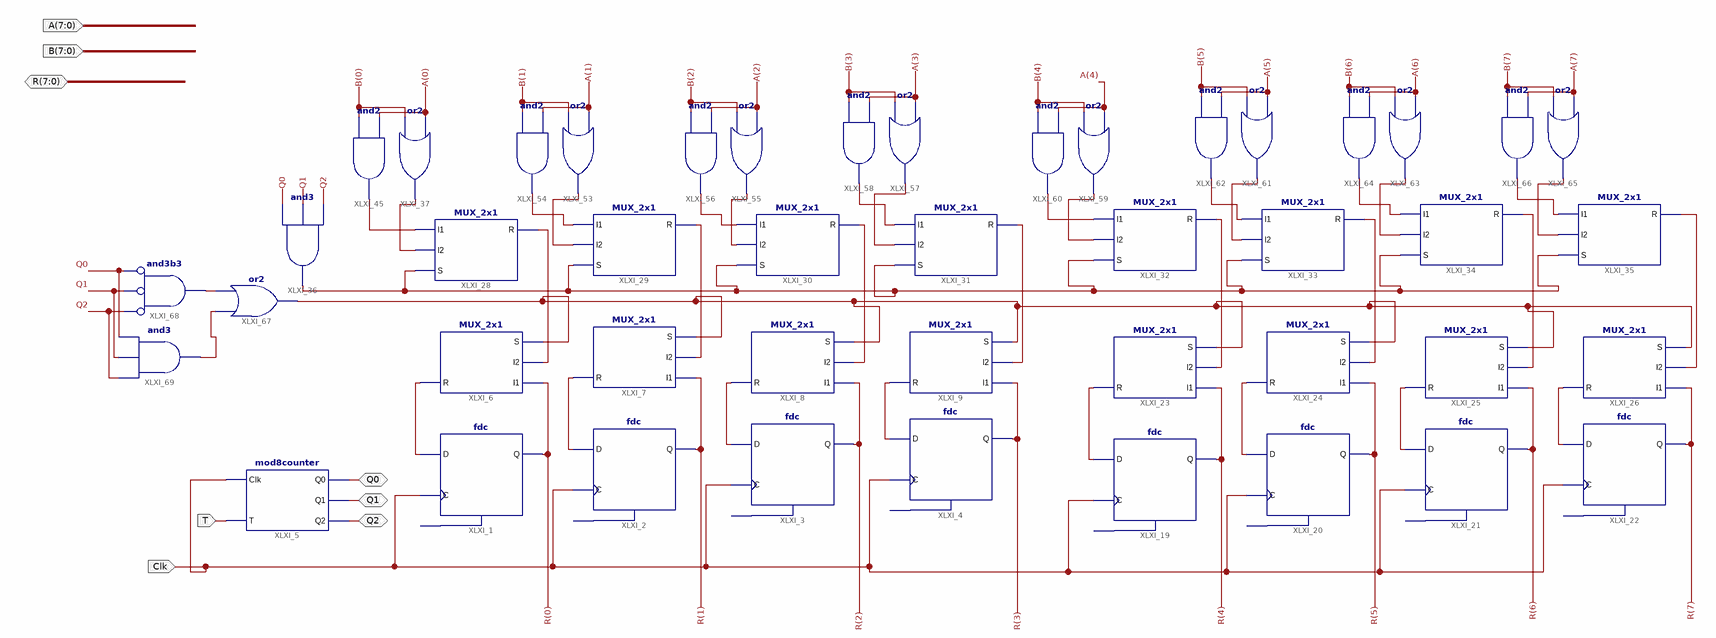
[diagram p0: schematic sheet 1]
// Xilinx ISE schematic first_h.sch (spartan3) as structural Verilog: 45 symbols, 8 ports
module first_h (
  input  T,
  input  Clk,
  input  [7:0] A,
  input  [7:0] B,
  inout  Q0,
  inout  Q2,
  inout  Q1,
  inout  [7:0] R
);

  wire XLXN_7, XLXN_8, XLXN_9, XLXN_10, XLXN_15, XLXN_40, XLXN_41, XLXN_42, XLXN_43, XLXN_54, XLXN_55,
       XLXN_56, XLXN_57, XLXN_58, XLXN_59, XLXN_60, XLXN_61, XLXN_70, XLXN_90, XLXN_91, XLXN_92, XLXN_93,
       XLXN_94, XLXN_96, XLXN_97, XLXN_98, XLXN_100, XLXN_102, XLXN_103, XLXN_104, XLXN_105, XLXN_106,
       XLXN_107, XLXN_108, XLXN_112, XLXN_113;

  fdc XLXI_1 (.C(Clk), .D(XLXN_7), .Q(R[0]));  // open: CLR
  fdc XLXI_2 (.C(Clk), .D(XLXN_8), .Q(R[1]));  // open: CLR
  fdc XLXI_3 (.C(Clk), .D(XLXN_9), .Q(R[2]));  // open: CLR
  fdc XLXI_4 (.C(Clk), .D(XLXN_10), .Q(R[3]));  // open: CLR
  mod8counter XLXI_5 (.Clk(Clk), .T(T), .Q0(Q0), .Q1(Q1), .Q2(Q2));
  MUX_2x1 XLXI_6 (.I1(R[0]), .I2(XLXN_54), .S(XLXN_15), .R(XLXN_7));
  MUX_2x1 XLXI_7 (.I1(R[1]), .I2(XLXN_55), .S(XLXN_15), .R(XLXN_8));
  MUX_2x1 XLXI_8 (.I1(R[2]), .I2(XLXN_56), .S(XLXN_15), .R(XLXN_9));
  MUX_2x1 XLXI_9 (.I1(R[3]), .I2(XLXN_57), .S(XLXN_15), .R(XLXN_10));
  fdc XLXI_19 (.C(Clk), .D(XLXN_40), .Q(R[4]));  // open: CLR
  fdc XLXI_20 (.C(Clk), .D(XLXN_41), .Q(R[5]));  // open: CLR
  fdc XLXI_21 (.C(Clk), .D(XLXN_42), .Q(R[6]));  // open: CLR
  fdc XLXI_22 (.C(Clk), .D(XLXN_43), .Q(R[7]));  // open: CLR
  MUX_2x1 XLXI_23 (.I1(R[4]), .I2(XLXN_58), .S(XLXN_15), .R(XLXN_40));
  MUX_2x1 XLXI_24 (.I1(R[5]), .I2(XLXN_59), .S(XLXN_15), .R(XLXN_41));
  MUX_2x1 XLXI_25 (.I1(R[6]), .I2(XLXN_60), .S(XLXN_15), .R(XLXN_42));
  MUX_2x1 XLXI_26 (.I1(R[7]), .I2(XLXN_61), .S(XLXN_15), .R(XLXN_43));
  MUX_2x1 XLXI_28 (.I1(XLXN_91), .I2(XLXN_90), .S(XLXN_70), .R(XLXN_54));
  MUX_2x1 XLXI_29 (.I1(XLXN_92), .I2(XLXN_93), .S(XLXN_70), .R(XLXN_55));
  MUX_2x1 XLXI_30 (.I1(XLXN_94), .I2(XLXN_96), .S(XLXN_70), .R(XLXN_56));
  MUX_2x1 XLXI_31 (.I1(XLXN_97), .I2(XLXN_98), .S(XLXN_70), .R(XLXN_57));
  MUX_2x1 XLXI_32 (.I1(XLXN_100), .I2(XLXN_102), .S(XLXN_70), .R(XLXN_58));
  MUX_2x1 XLXI_33 (.I1(XLXN_103), .I2(XLXN_104), .S(XLXN_70), .R(XLXN_59));
  MUX_2x1 XLXI_34 (.I1(XLXN_105), .I2(XLXN_106), .S(XLXN_70), .R(XLXN_60));
  MUX_2x1 XLXI_35 (.I1(XLXN_107), .I2(XLXN_108), .S(XLXN_70), .R(XLXN_61));
  and XLXI_36 (XLXN_70, Q0, Q1, Q2);
  or XLXI_37 (XLXN_90, B[0], A[0]);
  and XLXI_45 (XLXN_91, B[0], A[0]);
  or XLXI_53 (XLXN_93, B[1], A[1]);
  and XLXI_54 (XLXN_92, B[1], A[1]);
  or XLXI_55 (XLXN_96, B[2], A[2]);
  and XLXI_56 (XLXN_94, B[2], A[2]);
  or XLXI_57 (XLXN_98, B[3], A[3]);
  and XLXI_58 (XLXN_97, B[3], A[3]);
  or XLXI_59 (XLXN_102, B[4], A[4]);
  and XLXI_60 (XLXN_100, B[4], A[4]);
  or XLXI_61 (XLXN_104, B[5], A[5]);
  and XLXI_62 (XLXN_103, B[5], A[5]);
  or XLXI_63 (XLXN_106, B[6], A[6]);
  and XLXI_64 (XLXN_105, B[6], A[6]);
  or XLXI_65 (XLXN_108, B[7], A[7]);
  and XLXI_66 (XLXN_107, B[7], A[7]);
  or XLXI_67 (XLXN_15, XLXN_113, XLXN_112);
  and XLXI_68 (XLXN_112, ~Q2, ~Q1, ~Q0);  // and3b3
  and XLXI_69 (XLXN_113, Q2, Q1, Q0);
endmodule
